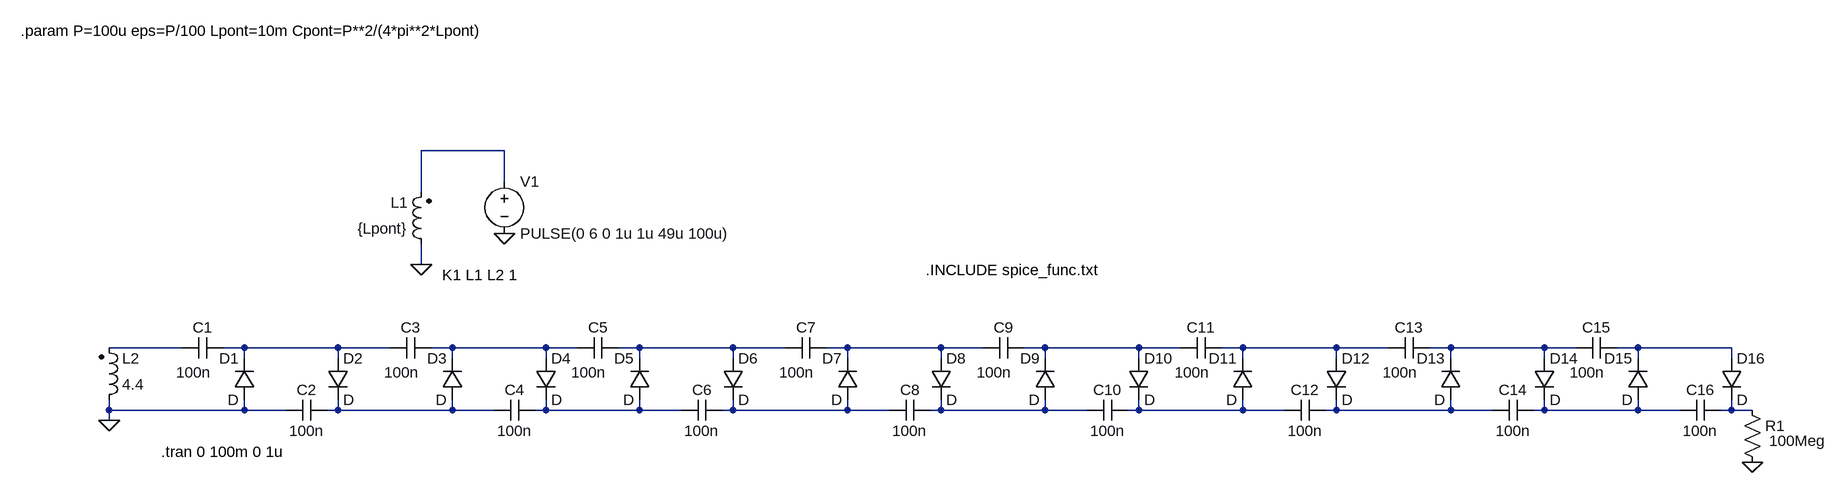
[diagram p0: schematic synoptiqueMultiplier.asc]
synoptiqueMultiplier.asc, the LTspice schematic file:
Version 4
SHEET 1 1968 680
WIRE -80 -192 -208 -192
WIRE -80 -144 -80 -192
WIRE -208 -128 -208 -192
WIRE -208 -16 -208 -48
WIRE -576 112 -688 112
WIRE -480 112 -512 112
WIRE -336 112 -480 112
WIRE -256 112 -336 112
WIRE -160 112 -192 112
WIRE -16 112 -160 112
WIRE 32 112 -16 112
WIRE 128 112 96 112
WIRE 272 112 128 112
WIRE 352 112 272 112
WIRE 448 112 416 112
WIRE 592 112 448 112
WIRE 656 112 592 112
WIRE 752 112 720 112
WIRE 896 112 752 112
WIRE 960 112 896 112
WIRE 1056 112 1024 112
WIRE 1200 112 1056 112
WIRE 1280 112 1200 112
WIRE 1376 112 1344 112
WIRE 1520 112 1376 112
WIRE 1568 112 1520 112
WIRE 1664 112 1632 112
WIRE 1808 112 1664 112
WIRE -480 128 -480 112
WIRE -336 128 -336 112
WIRE -160 128 -160 112
WIRE -16 128 -16 112
WIRE 128 128 128 112
WIRE 272 128 272 112
WIRE 448 128 448 112
WIRE 592 128 592 112
WIRE 752 128 752 112
WIRE 896 128 896 112
WIRE 1056 128 1056 112
WIRE 1200 128 1200 112
WIRE 1376 128 1376 112
WIRE 1520 128 1520 112
WIRE 1664 128 1664 112
WIRE 1808 128 1808 112
WIRE -688 208 -688 192
WIRE -480 208 -480 192
WIRE -480 208 -688 208
WIRE -416 208 -480 208
WIRE -336 208 -336 192
WIRE -336 208 -352 208
WIRE -160 208 -160 192
WIRE -160 208 -336 208
WIRE -96 208 -160 208
WIRE -16 208 -16 192
WIRE -16 208 -32 208
WIRE 128 208 128 192
WIRE 128 208 -16 208
WIRE 192 208 128 208
WIRE 272 208 272 192
WIRE 272 208 256 208
WIRE 448 208 448 192
WIRE 448 208 272 208
WIRE 512 208 448 208
WIRE 592 208 592 192
WIRE 592 208 576 208
WIRE 752 208 752 192
WIRE 752 208 592 208
WIRE 816 208 752 208
WIRE 896 208 896 192
WIRE 896 208 880 208
WIRE 1056 208 1056 192
WIRE 1056 208 896 208
WIRE 1120 208 1056 208
WIRE 1200 208 1200 192
WIRE 1200 208 1184 208
WIRE 1376 208 1376 192
WIRE 1376 208 1200 208
WIRE 1440 208 1376 208
WIRE 1520 208 1520 192
WIRE 1520 208 1504 208
WIRE 1664 208 1664 192
WIRE 1664 208 1520 208
WIRE 1728 208 1664 208
WIRE 1808 208 1808 192
WIRE 1808 208 1792 208
WIRE 1840 208 1808 208
WIRE -688 224 -688 208
FLAG -688 224 0
FLAG 1840 288 0
FLAG -208 -16 0
FLAG -80 -64 0
SYMBOL cap -512 96 R90
WINDOW 0 0 32 VBottom 2
WINDOW 3 38 46 VTop 2
SYMATTR InstName C1
SYMATTR Value 100n
SYMBOL cap -352 192 R90
WINDOW 0 0 32 VBottom 2
WINDOW 3 32 32 VTop 2
SYMATTR InstName C2
SYMATTR Value 100n
SYMBOL diode -464 192 R180
WINDOW 0 24 64 Left 2
WINDOW 3 24 0 Left 2
SYMATTR InstName D1
SYMBOL diode -352 128 R0
SYMATTR InstName D2
SYMBOL cap -192 96 R90
WINDOW 0 0 32 VBottom 2
WINDOW 3 38 46 VTop 2
SYMATTR InstName C3
SYMATTR Value 100n
SYMBOL diode -144 192 R180
WINDOW 0 24 64 Left 2
WINDOW 3 24 0 Left 2
SYMATTR InstName D3
SYMBOL cap -32 192 R90
WINDOW 0 0 32 VBottom 2
WINDOW 3 32 32 VTop 2
SYMATTR InstName C4
SYMATTR Value 100n
SYMBOL diode -32 128 R0
SYMATTR InstName D4
SYMBOL res 1824 192 R0
WINDOW 3 42 63 Left 2
SYMATTR Value 100Meg
SYMATTR InstName R1
SYMBOL ind2 -192 -32 R180
WINDOW 0 36 80 Left 2
WINDOW 3 36 40 Left 2
SYMATTR InstName L1
SYMATTR Value {Lpont}
SYMATTR Type ind
SYMATTR SpiceLine Rser=1m
SYMBOL ind2 -704 208 M180
WINDOW 0 36 80 Left 2
WINDOW 3 36 40 Left 2
SYMATTR InstName L2
SYMATTR Value 4.4
SYMATTR Type ind
SYMBOL voltage -80 -160 R0
WINDOW 123 0 0 Left 2
WINDOW 39 0 0 Left 2
SYMATTR InstName V1
SYMATTR Value PULSE(0 6 0 1u 1u 49u 100u)
SYMBOL cap 96 96 R90
WINDOW 0 0 32 VBottom 2
WINDOW 3 38 46 VTop 2
SYMATTR InstName C5
SYMATTR Value 100n
SYMBOL cap 256 192 R90
WINDOW 0 0 32 VBottom 2
WINDOW 3 32 32 VTop 2
SYMATTR InstName C6
SYMATTR Value 100n
SYMBOL diode 144 192 R180
WINDOW 0 24 64 Left 2
WINDOW 3 24 0 Left 2
SYMATTR InstName D5
SYMBOL diode 256 128 R0
SYMATTR InstName D6
SYMBOL cap 416 96 R90
WINDOW 0 0 32 VBottom 2
WINDOW 3 38 46 VTop 2
SYMATTR InstName C7
SYMATTR Value 100n
SYMBOL diode 464 192 R180
WINDOW 0 24 64 Left 2
WINDOW 3 24 0 Left 2
SYMATTR InstName D7
SYMBOL cap 576 192 R90
WINDOW 0 0 32 VBottom 2
WINDOW 3 32 32 VTop 2
SYMATTR InstName C8
SYMATTR Value 100n
SYMBOL diode 576 128 R0
SYMATTR InstName D8
SYMBOL cap 720 96 R90
WINDOW 0 0 32 VBottom 2
WINDOW 3 38 46 VTop 2
SYMATTR InstName C9
SYMATTR Value 100n
SYMBOL diode 768 192 R180
WINDOW 0 24 64 Left 2
WINDOW 3 24 0 Left 2
SYMATTR InstName D9
SYMBOL cap 880 192 R90
WINDOW 0 0 32 VBottom 2
WINDOW 3 32 32 VTop 2
SYMATTR InstName C10
SYMATTR Value 100n
SYMBOL diode 880 128 R0
SYMATTR InstName D10
SYMBOL cap 1024 96 R90
WINDOW 0 0 32 VBottom 2
WINDOW 3 38 46 VTop 2
SYMATTR InstName C11
SYMATTR Value 100n
SYMBOL diode 1072 192 R180
WINDOW 0 24 64 Left 2
WINDOW 3 24 0 Left 2
SYMATTR InstName D11
SYMBOL cap 1184 192 R90
WINDOW 0 0 32 VBottom 2
WINDOW 3 32 32 VTop 2
SYMATTR InstName C12
SYMATTR Value 100n
SYMBOL diode 1184 128 R0
SYMATTR InstName D12
SYMBOL cap 1344 96 R90
WINDOW 0 0 32 VBottom 2
WINDOW 3 38 46 VTop 2
SYMATTR InstName C13
SYMATTR Value 100n
SYMBOL diode 1392 192 R180
WINDOW 0 24 64 Left 2
WINDOW 3 24 0 Left 2
SYMATTR InstName D13
SYMBOL cap 1504 192 R90
WINDOW 0 0 32 VBottom 2
WINDOW 3 32 32 VTop 2
SYMATTR InstName C14
SYMATTR Value 100n
SYMBOL diode 1504 128 R0
SYMATTR InstName D14
SYMBOL cap 1632 96 R90
WINDOW 0 0 32 VBottom 2
WINDOW 3 38 46 VTop 2
SYMATTR InstName C15
SYMATTR Value 100n
SYMBOL diode 1680 192 R180
WINDOW 0 24 64 Left 2
WINDOW 3 24 0 Left 2
SYMATTR InstName D15
SYMBOL cap 1792 192 R90
WINDOW 0 0 32 VBottom 2
WINDOW 3 32 32 VTop 2
SYMATTR InstName C16
SYMATTR Value 100n
SYMBOL diode 1792 128 R0
SYMATTR InstName D16
TEXT -608 272 Left 2 !.tran 0 100m 0 1u
TEXT 568 -8 Left 2 !.INCLUDE spice_func.txt
TEXT -824 -376 Left 2 !.param P=100u eps=P/100 Lpont=10m Cpont=P**2/(4*pi**2*Lpont)
TEXT -176 0 Left 2 !K1 L1 L2 1

The netlist it stands for:
* synoptiqueMultiplier.asc
C1 N003 N002 100n
C2 N011 0 100n
D1 0 N003 D
D2 N003 N011 D
C3 N004 N003 100n
D3 N011 N004 D
C4 N012 N011 100n
D4 N004 N012 D
R1 N018 0 100Meg
L1 0 N001 {Lpont} Rser=1m
L2 0 N002 4.4
V1 N001 0 PULSE(0 6 0 1u 1u 49u 100u)
C5 N005 N004 100n
C6 N013 N012 100n
D5 N012 N005 D
D6 N005 N013 D
C7 N006 N005 100n
D7 N013 N006 D
C8 N014 N013 100n
D8 N006 N014 D
C9 N007 N006 100n
D9 N014 N007 D
C10 N015 N014 100n
D10 N007 N015 D
C11 N008 N007 100n
D11 N015 N008 D
C12 N016 N015 100n
D12 N008 N016 D
C13 N009 N008 100n
D13 N016 N009 D
C14 N017 N016 100n
D14 N009 N017 D
C15 N010 N009 100n
D15 N017 N010 D
C16 N018 N017 100n
D16 N010 N018 D
.model D D
.lib standard.dio
.tran 0 100m 0 1u
.INCLUDE spice_func.txt
.param P=100u eps=P/100 Lpont=10m Cpont=P**2/(4*pi**2*Lpont)
K1 L1 L2 1
.backanno
.end